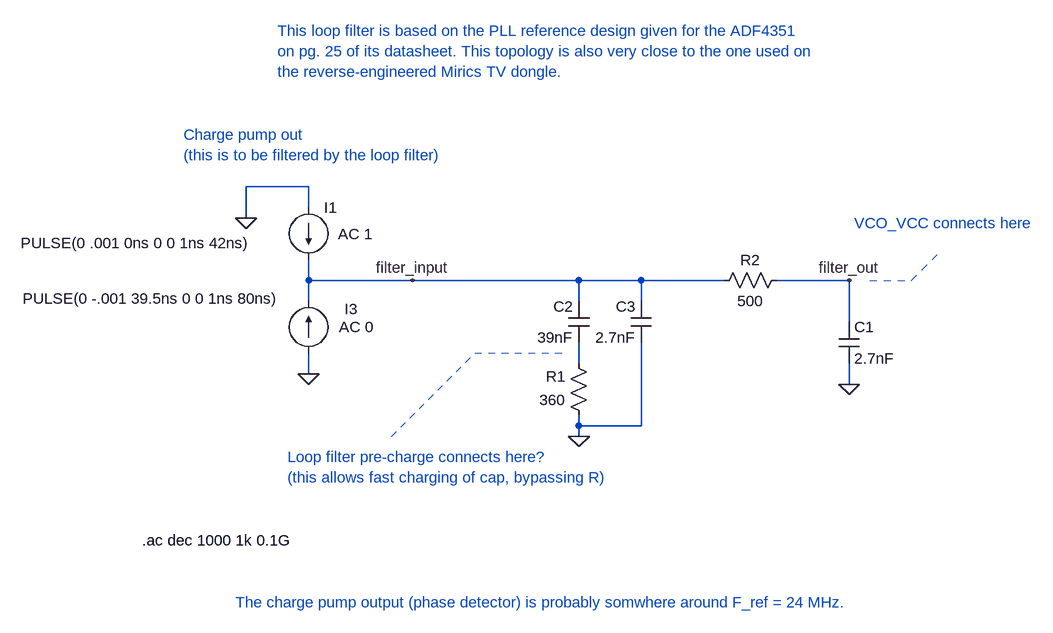
[diagram p0: schematic MSi001_VCO_stuff.asc]
MSi001_VCO_stuff.asc, the LTspice schematic file:
Version 4
SHEET 1 1396 812
WIRE -464 128 -560 128
WIRE -464 160 -464 128
WIRE -560 176 -560 128
WIRE -464 272 -464 240
WIRE -304 272 -464 272
WIRE -48 272 -304 272
WIRE 48 272 -48 272
WIRE 176 272 48 272
WIRE 368 272 256 272
WIRE -464 304 -464 272
WIRE -48 304 -48 272
WIRE 48 304 48 272
WIRE 368 336 368 272
WIRE -48 400 -48 368
WIRE -464 416 -464 384
WIRE 368 432 368 400
WIRE -48 496 -48 480
WIRE 48 496 48 368
WIRE 48 496 -48 496
WIRE -48 512 -48 496
FLAG -560 176 0
FLAG -464 416 0
FLAG 368 432 0
FLAG -48 512 0
FLAG -304 272 filter_input
FLAG 368 272 filter_out
SYMBOL cap 352 336 R0
SYMATTR InstName C1
SYMATTR Value 2.7nF
SYMBOL cap -32 368 R180
WINDOW 0 24 56 Left 2
WINDOW 3 24 8 Left 2
SYMATTR InstName C2
SYMATTR Value 39nF
SYMBOL cap 64 368 R180
WINDOW 0 24 56 Left 2
WINDOW 3 24 8 Left 2
SYMATTR InstName C3
SYMATTR Value 2.7nF
SYMBOL res -32 496 R180
WINDOW 0 36 76 Left 2
WINDOW 3 36 40 Left 2
SYMATTR InstName R1
SYMATTR Value 360
SYMBOL current -464 160 R0
WINDOW 123 45 41 Left 2
WINDOW 39 0 0 Left 0
WINDOW 3 -443 55 Left 2
SYMATTR Value2 AC 1
SYMATTR Value PULSE(0 .001 0ns 0 0 1ns 42ns)
SYMATTR InstName I1
SYMBOL current -464 384 R180
WINDOW 123 -100 40 Left 2
WINDOW 39 0 0 Left 0
WINDOW 0 -76 68 Left 2
WINDOW 3 45 84 Left 2
SYMATTR Value2 AC 0
SYMATTR InstName I3
SYMATTR Value PULSE(0 -.001 39.5ns 0 0 1ns 80ns)
SYMBOL res 272 256 R90
WINDOW 0 0 56 VBottom 2
WINDOW 3 32 56 VTop 2
SYMATTR InstName R2
SYMATTR Value 500
TEXT -496 544 Left 2 ;Loop filter pre-charge connects here?\n(this allows fast charging of cap, bypassing R)
TEXT 376 184 Left 2 ;VCO_VCC connects here
TEXT -656 48 Left 2 ;Charge pump out\n(this is to be filtered by the loop filter)
TEXT -720 672 Left 2 !.ac dec 1000 1k 0.1G
TEXT -512 -112 Left 2 ;This loop filter is based on the PLL reference design given for the ADF4351 \non pg. 25 of its datasheet. This topology is also very close to the one used on\nthe reverse-engineered Mirics TV dongle.
TEXT -576 768 Left 2 ;The charge pump output (phase detector) is probably somwhere around F_ref = 24 MHz.
LINE Normal -208 384 -64 384 2
LINE Normal -336 512 -208 384 2
LINE Normal 464 272 512 224 2
LINE Normal 400 272 464 272 2

The netlist it stands for:
* MSi001_VCO_stuff.asc
C1 filter_out 0 2.7nF
C2 N001 filter_input 39nF
C3 0 filter_input 2.7nF
R1 0 N001 360
I1 0 filter_input PULSE(0 .001 0ns 0 0 1ns 42ns) AC 1
I3 0 filter_input PULSE(0 -.001 39.5ns 0 0 1ns 80ns) AC 0
R2 filter_out filter_input 500
* Loop filter pre-charge connects here?
* (this allows fast charging of cap, bypassing R)
* VCO_VCC connects here
* Charge pump out
* (this is to be filtered by the loop filter)
.ac dec 1000 1k 0.1G
* This loop filter is based on the PLL reference design given for the ADF4351
* on pg. 25 of its datasheet. This topology is also very close to the one used on
* the reverse-engineered Mirics TV dongle.
* The charge pump output (phase detector) is probably somwhere around F_ref = 24 MHz.
.backanno
.end